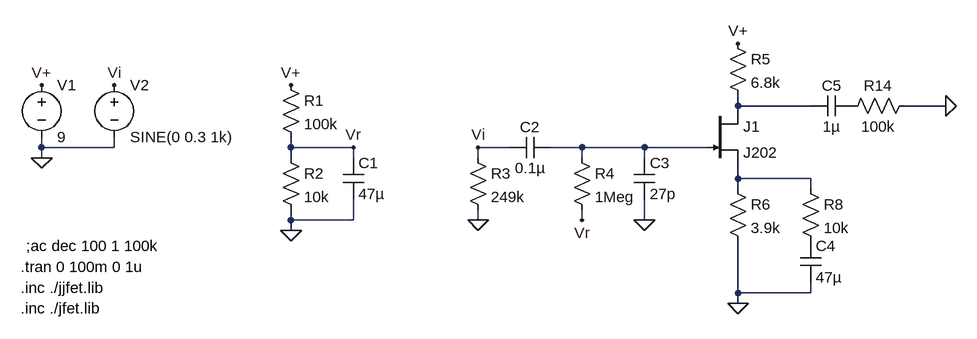
[diagram p0: schematic JFET_C.asc]
JFET_C.asc, the LTspice schematic file:
Version 4
SHEET 1 2216 680
WIRE 1088 112 1088 96
WIRE 1200 112 1088 112
WIRE 1408 112 1344 112
WIRE 16 176 16 160
WIRE 128 176 128 160
WIRE 128 176 16 176
WIRE 400 176 400 160
WIRE 496 176 400 176
WIRE 736 176 688 176
WIRE 848 176 800 176
WIRE 944 176 848 176
WIRE 1040 176 944 176
WIRE 16 192 16 176
WIRE 400 192 400 176
WIRE 496 192 496 176
WIRE 688 192 688 176
WIRE 848 192 848 176
WIRE 944 192 944 176
WIRE 1088 224 1088 208
WIRE 1200 224 1088 224
WIRE 1088 240 1088 224
WIRE 1200 240 1200 224
WIRE 400 288 400 272
WIRE 496 288 496 256
WIRE 496 288 400 288
WIRE 688 288 688 272
WIRE 848 288 848 272
WIRE 944 288 944 256
WIRE 400 304 400 288
WIRE 1088 400 1088 320
WIRE 1200 400 1200 384
WIRE 1200 400 1088 400
WIRE 1088 416 1088 400
FLAG 16 192 0
FLAG 16 80 V+
FLAG 128 80 Vi
FLAG 400 80 V+
FLAG 496 176 Vr
FLAG 400 304 0
FLAG 944 288 0
FLAG 688 288 0
FLAG 848 288 Vr
FLAG 1088 16 V+
FLAG 688 176 Vi
FLAG 1088 416 0
FLAG 1408 112 0
SYMBOL voltage 16 64 R0
SYMATTR InstName V1
SYMATTR Value 9
SYMBOL voltage 128 64 R0
SYMATTR InstName V2
SYMATTR Value SINE(0 0.3 1k)
SYMATTR Value2 AC 1 0
SYMBOL res 384 64 R0
SYMATTR InstName R1
SYMATTR Value 100k
SYMBOL res 384 176 R0
SYMATTR InstName R2
SYMATTR Value 10k
SYMBOL cap 480 192 R0
SYMATTR InstName C1
SYMATTR Value 47µ
SYMBOL res 672 176 R0
SYMATTR InstName R3
SYMATTR Value 249k
SYMBOL cap 800 160 R90
WINDOW 0 0 32 VBottom 2
WINDOW 3 32 32 VTop 2
SYMATTR InstName C2
SYMATTR Value 0.1µ
SYMBOL res 832 176 R0
SYMATTR InstName R4
SYMATTR Value 1Meg
SYMBOL cap 928 192 R0
SYMATTR InstName C3
SYMATTR Value 27p
SYMBOL njf 1040 112 R0
SYMATTR InstName J1
SYMATTR Value J202
SYMBOL res 1072 0 R0
SYMATTR InstName R5
SYMATTR Value 6.8k
SYMBOL res 1072 224 R0
SYMATTR InstName R6
SYMATTR Value 3.9k
SYMBOL cap 1264 96 R90
WINDOW 0 0 32 VBottom 2
WINDOW 3 32 32 VTop 2
SYMATTR InstName C5
SYMATTR Value 1µ
SYMBOL cap 1184 320 R0
SYMATTR InstName C4
SYMATTR Value 47µ
SYMBOL res 1184 224 R0
SYMATTR InstName R8
SYMATTR Value 10k
SYMBOL res 1360 96 R90
WINDOW 0 0 56 VBottom 2
WINDOW 3 32 56 VTop 2
SYMATTR InstName R14
SYMATTR Value 100k
TEXT -16 360 Left 2 !.tran 0 100m 0 1u
TEXT -16 392 Left 2 !.inc ./jjfet.lib
TEXT -16 424 Left 2 !.inc ./jfet.lib
TEXT -8 328 Left 2 !;ac dec 100 1 100k

The netlist it stands for:
* JFET_C.asc
V1 V+ 0 9
V2 Vi 0 SINE(0 0.3 1k) AC 1 0
R1 V+ Vr 100k
R2 Vr 0 10k
C1 Vr 0 47µ
R3 Vi 0 249k
C2 N002 Vi 0.1µ
R4 N002 Vr 1Meg
C3 N002 0 27p
J1 N001 N002 N003 J202
R5 V+ N001 6.8k
R6 N003 0 3.9k
C5 P001 N001 1µ
C4 P002 0 47µ
R8 N003 P002 10k
R14 0 P001 100k
.model NJF NJF
.model PJF PJF
.lib standard.jft
.tran 0 100m 0 1u
.inc ./jjfet.lib
.inc ./jfet.lib
;ac dec 100 1 100k
.backanno
.end